# EAGLE design 12V_power_rail (EAGLE 7.3.0)
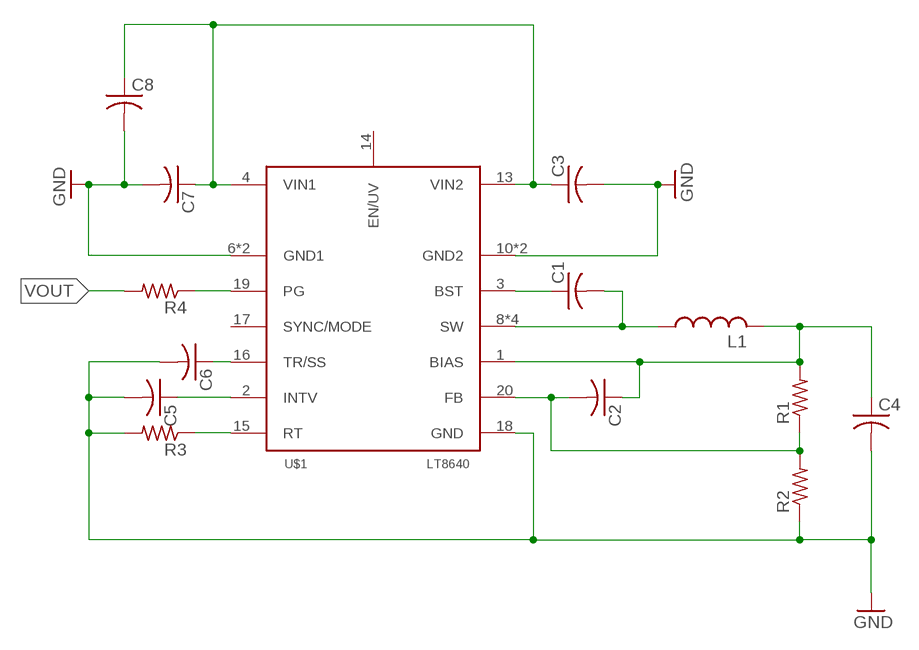
[diagram p0: schematic, sheet 1]

## Parts
C1  C-USC0402  [C0402]
C2  C-USC0402  [C0402]
C3  C-USC0402  [C0402]
C4  C-USC1210  [C1210]
C5  C-USC0402  [C0402]
C6  C-USC0402  [C0402]
C7  C-USC0402  [C0402]
C8  C-USC0603  [C0603]
L1  L-USIHLP2525EZER4R7M01  [IHLP2525EZER4R7M01-FOOT]
R1  R-US_R0402  [R0402]
R2  R-US_R0402  [R0402]
R3  R-US_R0402  [R0402]
R4  R-US_R0402  [R0402]
U$1  LT8640  [LT8640_FOOT]

## Nets
GND: C3.2 C4.2 C5.2 C6.2 C7.2 C8.2 R2.1 R3.2 U$1.6(GND1) U$1.7(GND1) U$1.10(GND2) U$1.11(GND2) U$1.18(GND)
N$1: C1.1 U$1.3(BST)
N$2: C1.2 L1.1 U$1.8(SW) U$1.9(SW) U$1.21(SW) U$1.22(SW)
N$3: R4.1 U$1.19(PG)
N$5: C2.2 R1.1 R2.2 U$1.20(FB)
N$10: C6.1 U$1.16(TR/SS)
N$11: C5.1 U$1.2(INTV)
N$12: R3.1 U$1.15(RT)
VIN: C3.1 C7.1 C8.1 U$1.4(VIN1) U$1.13(VIN2)
VOUT: C2.1 C4.1 L1.2 R1.2 R4.2 U$1.1(BIAS)
Unconnected: U$1.14(EN/UV) U$1.17(SYNC/MODE)

## Library data of the parts
C1-C8 = rcl:C-US: CAPACITOR, American symbol
L1 = Pi3_motor_hat_rev1:L-US: INDUCTOR, American symbol
R1-R4 = rcl:R-US_: RESISTOR, American symbol
U$1 = Pi3_motor_hat_rev1:LT8640

## Board
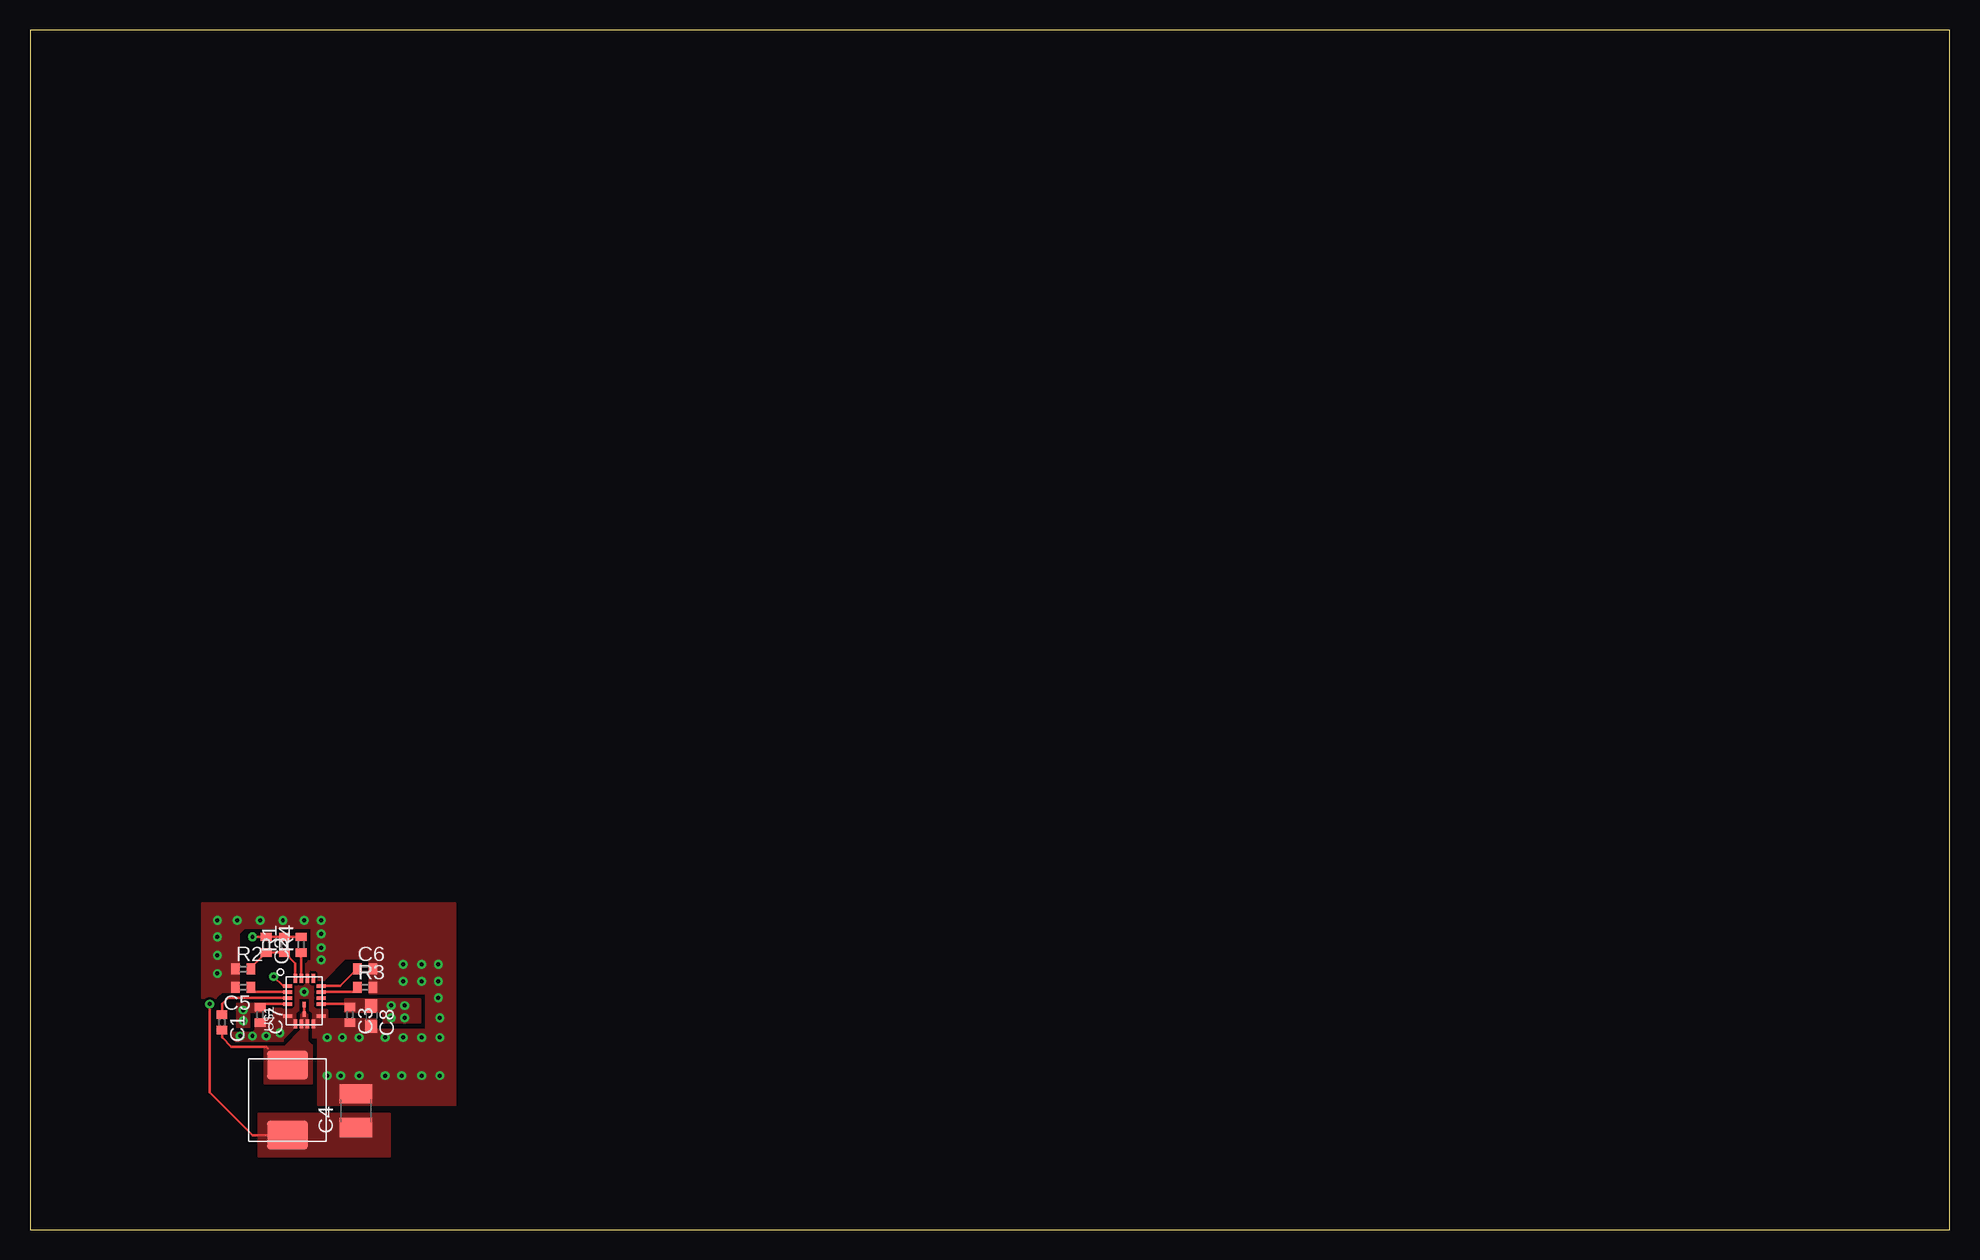
[diagram p1: board, top side]
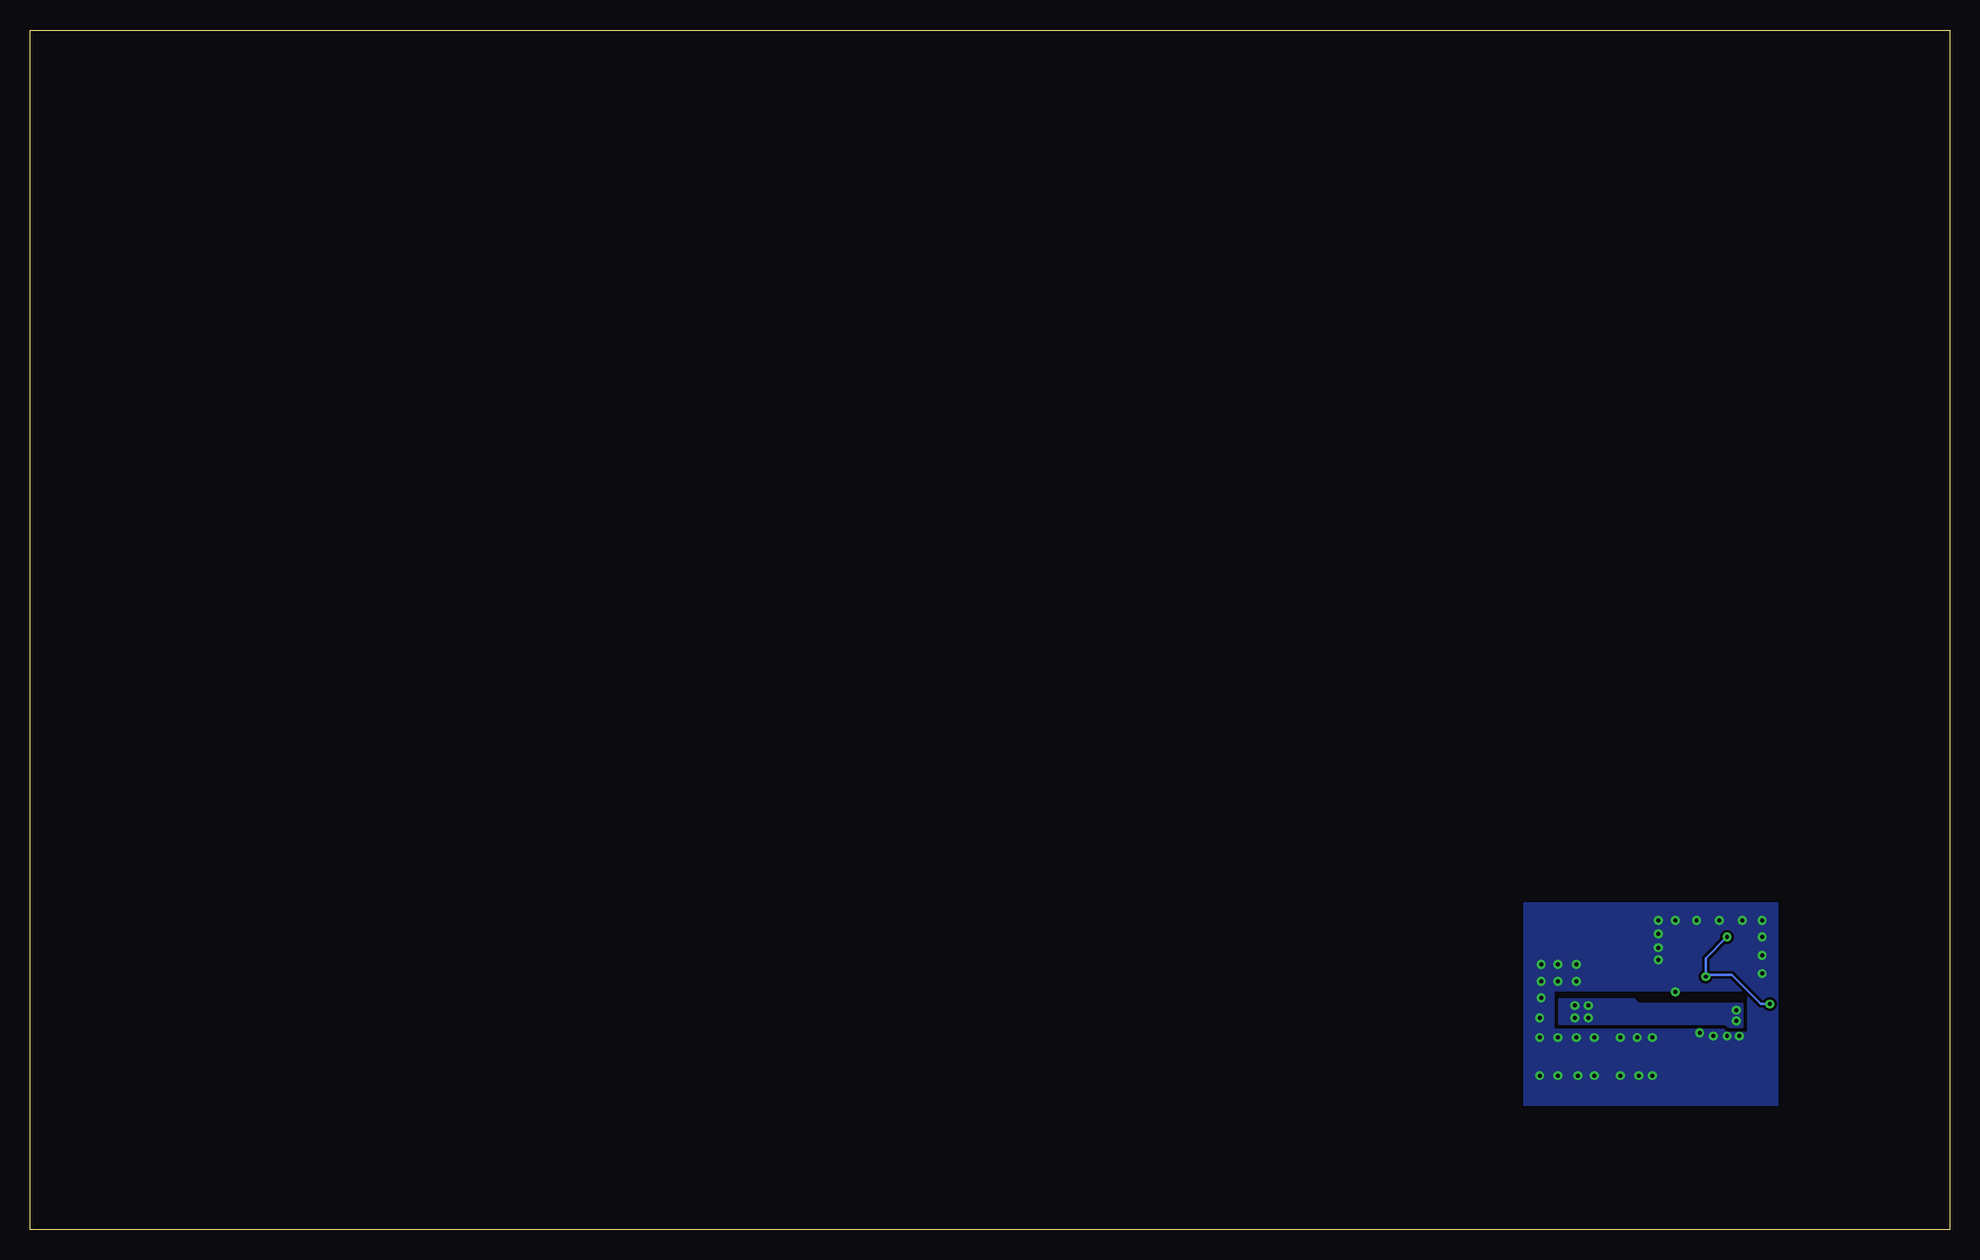
[diagram p2: board, bottom side, seen from below]

Size 160 x 100 mm. Coordinates in mm from the lower left corner, seen from the top.
Outline: 0,0 160,0 160,100 0,100 0,0
Copper layers (1*16): Top 0.035mm / dielectric 1.5mm / Bottom 0.035mm
Design rules "default": minimum track width 10mil, minimum drill 24mil, track to track 8mil, track to pad 8mil, pad to pad 8mil, via to via 8mil, smd to smd 8mil, copper to edge 40mil, drill to drill 8mil, minimum pad ring 10mil, minimum via ring 8mil, stop-mask expansion 4mil, vias tented up to drill 0mil, thermal gap 10mil

### Footprints (pad centres in the part's own frame; a part is rotated, then mirrored left to right if it is on the bottom)
C0402 = smd 0.7 x 0.9: 1 -0.65,0; 2 0.65,0
C1210 = smd 1.6 x 2.7: 1 -1.4,0; 2 1.4,0
C0603 = smd 1.1 x 1: 1 -0.85,0; 2 0.85,0
IHLP2525EZER4R7M01-FOOT = smd 2.413 x 3.429: 1 -2.921,0; 2 2.921,0
R0402 = smd 0.7 x 0.9: 1 -0.65,0; 2 0.65,0
LT8640_FOOT = smd 0.3 x 0.75: 1 1.25,1.4; 2 0.75,1.4; 3 0.25,1.4; 4 -0.25,1.4; 6 -1.25,1.4; 11 -1.25,-1.4; 13 -0.25,-1.4; 14 0.25,-1.4; 15 0.75,-1.4; 16 1.25,-1.4 | smd 0.75 x 0.3: 7 -1.9,0.75; 8 -1.9,0.25; 9 -1.9,-0.25; 10 -1.9,-0.75; 17 1.9,-0.75; 18 1.9,-0.25; 19 1.9,0.25; 20 1.9,0.75 | smd 0.45 x 0.27: 21 -1.075,0; 22 -0.305,0

### Placement (x,y rotation side)
C1  16,17.27 270 top
C2  19.68,23.75 270 top
C3  26.67,17.91 270 top
C4  27.18,9.91 90 top
C5  17.78,20.19 180 top
C6  27.94,21.72 0 top
C7  19.18,17.91 270 top
C8  28.45,17.78 270 top
L1  21.46,10.79 270 top
R1  21.21,23.75 90 top
R2  17.78,21.72 0 top
R3  27.94,20.19 0 top
R4  22.61,23.75 90 top
U$1  22.86,19.05 90 top

### Tracks (layer width: path | path; a pad name or v marks a point on that pad's centre or on a via)
GND  (via drill 0.33)
  other vias: 17.53,16.13 18.54,16.13 19.68,16.13 20.83,16.38 22.86,19.81 24.77,16 26.04,16 27.43,16 29.59,16 31.11,16 32.64,16 34.16,16 34.16,17.65 34.04,19.3 34.04,20.7 32.64,20.7 31.11,20.7 31.11,22.1 32.64,22.1 34.04,22.1 15.62,21.34 15.62,22.86 15.62,24.38 15.62,25.78 17.27,25.78 19.18,25.78 21.08,25.78 22.86,25.78 24.26,25.78 24.26,24.64 24.26,23.5 24.26,22.48 24.77,12.83 25.91,12.83 27.43,12.83 29.59,12.83 30.99,12.83 32.64,12.83 34.16,12.83
  pour Top (no thermals): 22.1,16.89 22.1,18.03 22.35,18.29 22.35,19.3 23.24,19.3 23.37,19.3 23.37,18.29 23.62,18.03 23.62,16 24.77,16 24.77,18.29 24.64,18.41 24.13,18.41 24.13,20.32 24.13,20.83 21.46,20.83 21.46,18.67 20.32,18.67 20.32,15.88 21.08,15.88
  pour Top (no thermals): 26.16,10.41 24,10.41 24,16 24,17.53 28.83,17.53 28.83,16.64 30.99,16.64 30.99,10.41
  pour Top (no thermals): 23.5,20.7 23.5,27.18 35.43,27.18 35.43,10.41 30.99,10.41 30.99,16.64 33.02,16.64 33.02,19.68 28.32,19.68 28.32,22.61 26.29,22.61 24.51,20.83 23.62,20.83
  pour Top (no thermals): 20.32,17.53 18.8,17.53 18.8,16.64 18.54,16.38 16.89,16.38 16.89,16 17.14,15.75 21.08,15.75 21.08,16.76
  pour Top (no thermals): 17.4,19.81 16,19.81 15.49,19.3 14.35,19.3 14.35,27.18 23.5,27.18 23.5,25.15 17.91,25.15 17.4,24.64
  pour Bottom: 16.76,18.03 16.76,16.38 18.54,16.38 18.8,16.64 33.02,16.64 33.02,19.81 35.43,19.81 35.43,10.41 14.61,10.41 14.35,10.41 14.35,19.94 16.76,19.94
  pour Bottom: 14.35,19.94 33.02,19.94 33.02,19.81 35.43,19.81 35.43,27.18 14.35,27.18
  pour Top (no thermals): 22.99,21.08 22.99,22.1 23.24,22.35 23.75,22.35 23.75,21.84 23.5,21.84 23.24,21.59 23.24,21.08
N$1
  Top 0.203: U$1.3 16.51,19.3 16,18.8 C1.1
N$2
  Top 0.203: U$1.22 U$1.21 | C1.2 16,16 16.76,15.24 19.68,15.24 19.81,15.11
  pour Top (no thermals): 21.34,12.19 19.56,12.19 19.56,15.24 21.21,15.24 22.61,16.64 22.61,17.91 22.73,18.03 22.99,18.03 23.11,17.91 23.11,17.53 23.11,15.75 23.5,15.37 23.5,12.19
N$3
  Top 0.203: U$1.19 R4.1
N$5
  Top 0.203: U$1.20 22.11,22.2 R1.1 C2.2 18.43,21.84 R2.2
N$10
  Top 0.203: U$1.16 25.87,20.3 C6.1
N$11
  Top 0.203: U$1.2 18.82,19.8 C5.1
N$12
  Top 0.203: U$1.15 26.9,19.8 R3.1
VIN  (via drill 0.33)
  Top 0.203: U$1.4 19.55,18.8 C7.1 | U$1.13 26.43,18.8 C3.1
  other vias: 17.78,18.29 17.78,17.4 30.1,18.67 31.24,18.67 30.1,17.65 31.24,17.65
  pour Top (no thermals): 26.29,18.16 29.21,18.16 29.46,17.91 29.46,17.27 32.51,17.27 32.51,19.18 26.29,19.18
  pour Top (no thermals): 19.56,18.16 18.41,18.16 18.29,18.03 18.29,16.89 17.27,16.89 17.27,18.8 19.56,18.8
  pour Bottom: 32.51,17.14 18.67,17.14 18.41,16.89 17.27,16.89 17.27,18.8 25.91,18.8 26.29,19.18 32.51,19.18
VOUT  (via drill 0.33)
  Top 0.203: U$1.1 21.1,20.3 v20.32,21.08 | v18.54,24.38 19.67,24.38 C2.1 R1.2 R4.2 | L1.2 18.54,7.87 14.99,11.43 v14.99,18.8
  Bottom 0.203: v18.54,24.38 20.32,22.61 v20.32,21.08 20.19,21.21 18.16,21.21 15.75,18.8 v14.99,18.8
  pour Top (no thermals): 27.18,9.65 19.05,9.65 19.05,6.1 29.97,6.1 29.97,9.65